# Altium project ORINIUM_UAV.PrjPcb (part 5 of 5)
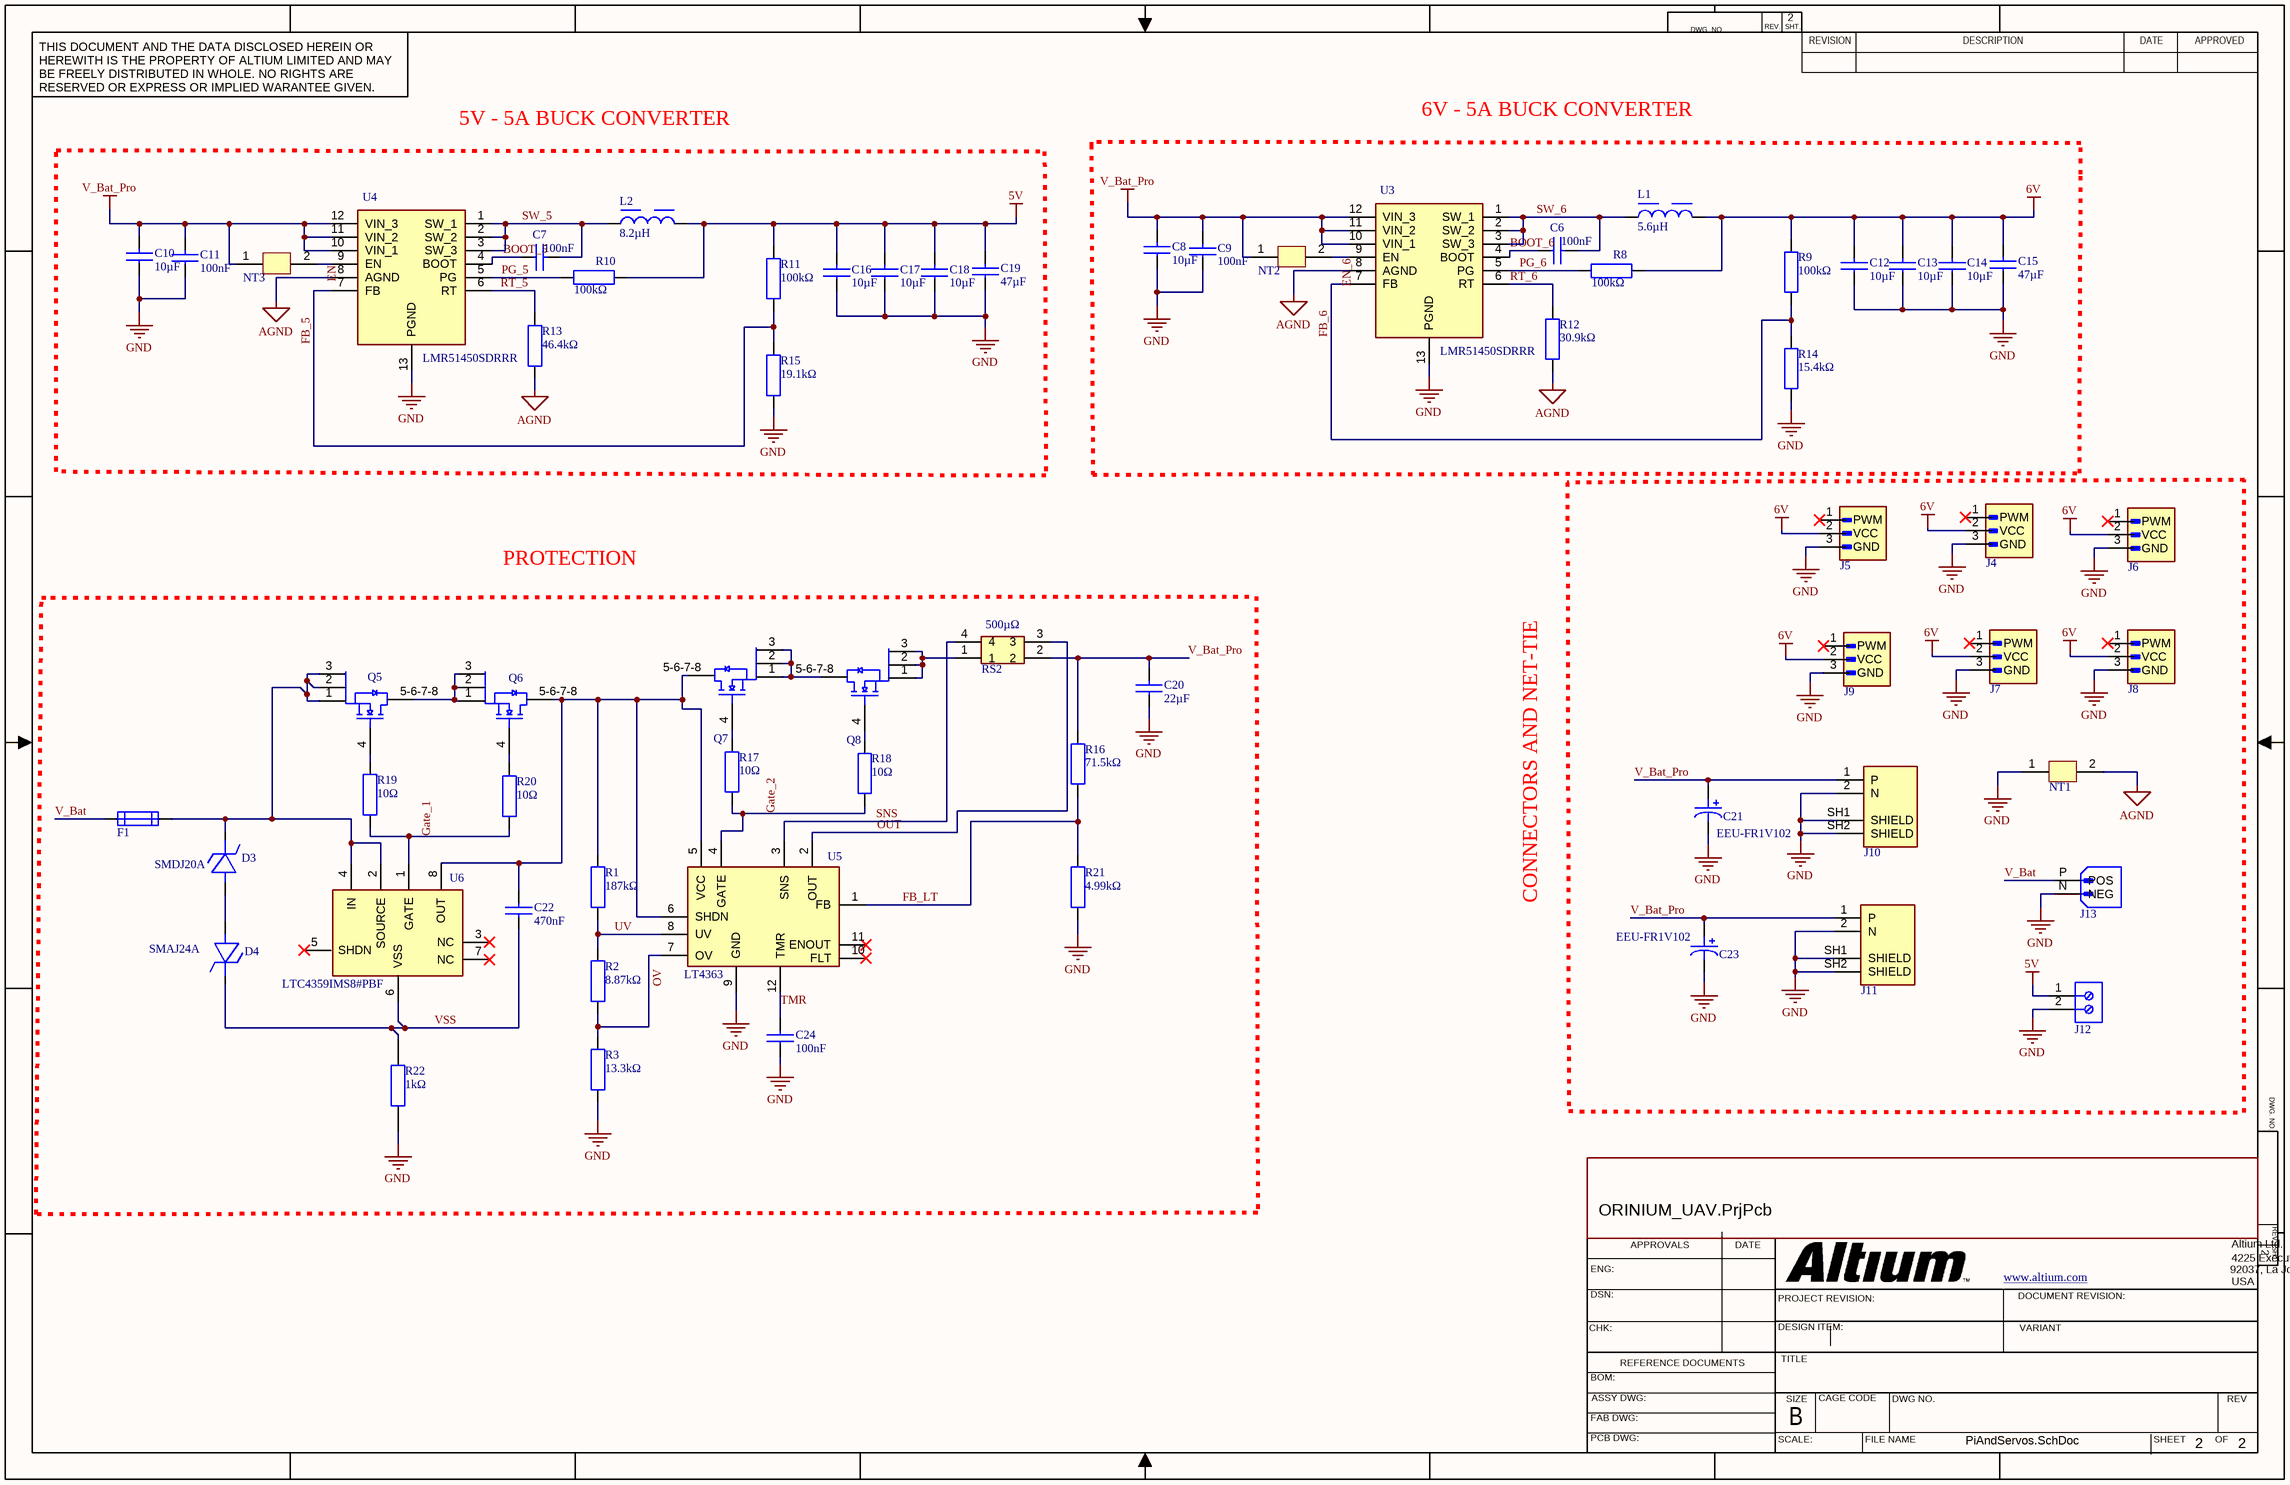
[diagram p4: PiAndServos.SchDoc]

## Sheet PiAndServos.SchDoc (continued)

### Library data of the parts (continued)
U6 = LTC4359IMS8#PBF: OR Controller N-Channel Single Automotive 8-Pin MSOP Tube / IC OR CTRLR N+1 8MSOP; Manufacturer: Analog Devices; Manufacturer Lifecycle Status: PRODUCTION; Max Output current: 180mA; Max Supply Voltage: 80V; Min Supply Voltage: 4V; Nominal Supply Current: 150µA; Number of Drivers: 1; Turn-Off Delay Time: 500ns; Supplier: Farnell; Supplier Part Number: LTC4359IMS8#PBF; Manufacturer Part Number: LTC4359IMS8#PBF; RoHS: Compliant; Category: Hot Swap Controllers; Stock: 348; Pricing: 1=9,08, 10=7,02, 50=6,69, 100=5,8, 250=5,55, 500=5,44 (EUR); Case/Package: MSOP; Lead Free: Lead Free; Lifecycle Status: Production; Max Operating Temperature: 85°C; Min Operating Temperature: -40°C; Number of Outputs: 1; Pins: 8; Schedule B: 8542310000, 8542390000, 8542390000|8542390000|8542390000|8542390000|8542390000|8542390000|8542390000|8542390000|8542390000|8542390000|8542390000|8542390000|8542390000|8542390000|8542390000|8542390000|8542390000|8542390000|8542390000|8542390000|8542390000|8542390000|8542390000|85; ComponentLink1URL: https://octopart.com:443/opatz8j6/c1?t=_P40TfJSJXDZt56jomm_QCaV2W9ovGhsmmsOr-jhAwoCJ8nBLABmPJZhMtd9jjF5hxL1_00-h1PSZMWNgisxjLor_nTRai5VSPSv7C30GKc6fB5Irl3JnoxXP6guWu3apPr0PFiiVpLUoXbJVRp6NFZQZkSSQtA-ym9nyDkwm4hFZ6aPWkuTkGMSIQRbKLFRiG3TpYClyGIEk8cre1-RNpxUfVtqVrzznXBdFvjW7k8HJfomxoh2QY9RslEN6MsN_sQCc8xlBgnroxPUy_RknD4svorm-bCFLp_eYvwDcJ65KenarPCoDA&src-supplier=Analog+Devices; ComponentLink1Description: https://octopart.com:443/opatz8j6/c1?t=_P40TfJSJXDZt56jomm_QCaV2W9ovGhsmmsOr-jhAwoCJ8nBLABmPJZhMtd9jjF5hxL1_00-h1PSZMWNgisxjLor_nTRai5VSPSv7C30GKc6fB5Irl3JnoxXP6guWu3apPr0PFiiVpLUoXbJVRp6NFZQZkSSQtA-ym9nyDkwm4hFZ6aPWkuTkGMSIQRbKLFRiG3TpYClyGIEk8cre1-RNpxUfVtqVrzznXBdFvjW7k8HJfomxoh2QY9RslEN6MsN_sQCc8xlBgnroxPUy_RknD4svorm-bCFLp_eYvwDcJ65KenarPCoDA&src-supplier=Analog+Devices; ComponentLink2URL: https://datasheet.octopart.com:443/LTC4359IMS8%23PBF-Analog-Devices-datasheet-140795748.pdf?src-supplier=element14+APAC; ComponentLink2Description: https://datasheet.octopart.com:443/LTC4359IMS8%23PBF-Analog-Devices-datasheet-140795748.pdf?src-supplier=element14+APAC; ComponentLink3URL: https://datasheet.octopart.com:443/LTC4359IMS8%23PBF-Analog-Devices-datasheet-158590489.pdf?src-supplier=Augswan; ComponentLink3Description: https://datasheet.octopart.com:443/LTC4359IMS8%23PBF-Analog-Devices-datasheet-158590489.pdf?src-supplier=Augswan; ComponentLink4URL: https://datasheet.octopart.com:443/LTC4359IMS8%23PBF-Linear-Technology-datasheet-57717354.pdf?src-supplier=Linear+Technology; ComponentLink4Description: https://datasheet.octopart.com:443/LTC4359IMS8%23PBF-Linear-Technology-datasheet-57717354.pdf?src-supplier=Linear+Technology; ComponentLink5URL: https://sigma.octopart.com:443/57689691/technical_drawing/Linear-Technology-LTC4359IMS8%23PBF.pdf?src-supplier=Linear+Technology; ComponentLink5Description: https://sigma.octopart.com:443/57689691/technical_drawing/Linear-Technology-LTC4359IMS8%23PBF.pdf?src-supplier=Linear+Technology; ComponentLink6URL: https://datasheet.octopart.com:443/LTC4359IMS8%23PBF-Linear-Technology-datasheet-11773680.pdf?src-supplier=Arrow+Electronics; ComponentLink6Description: https://datasheet.octopart.com:443/LTC4359IMS8%23PBF-Linear-Technology-datasheet-11773680.pdf?src-supplier=Arrow+Electronics; ComponentLink7URL: https://datasheet.octopart.com:443/LTC4359IMS8%23PBF-Analog-Devices-datasheet-14357927.pdf?src-supplier=Newchip+Electronics+Limited; ComponentLink7Description: https://datasheet.octopart.com:443/LTC4359IMS8%23PBF-Analog-Devices-datasheet-14357927.pdf?src-supplier=Newchip+Electronics+Limited; ComponentLink8URL: http://sigma.octopart.com:80/conflict_mineral_statement/Analog-Devices-company-33.pdf?src-supplier=Compliance+Statements; ComponentLink8Description: http://sigma.octopart.com:80/conflict_mineral_statement/Analog-Devices-company-33.pdf?src-supplier=Compliance+Statements; ComponentLink9URL: https://octopart.com:443/opatz8j6/c1?t=XMv486en4cgRczUhByXESygA7tzcWfPA65o52ghxq4CXCY5NS57rdy5GGbwVE8XfZyKs-Pss4HrKqDtDv8emV_VCOba_2B0i215LcHmypdXyqbKoV6hHKkyeszMd1G80nbJlVl28xOaq3ImAQwkx3MBKoeKSCRUWEeTh7O6SnaO6lulbOrhBpa7lUpYX2qexamutmNVBBP7Kuf_BfwVA6xNgWJaaLpoQaJnsVBxMCYgV8GT8S6w0VND9CLazxAvXxfuvXrc9_2mcoElFnkU-aAFDwJb3cbIgcdgtTW9GLMnN3gYe9mDzlQ&src-supplier=Compliance+Statements; ComponentLink9Description: https://octopart.com:443/opatz8j6/c1?t=XMv486en4cgRczUhByXESygA7tzcWfPA65o52ghxq4CXCY5NS57rdy5GGbwVE8XfZyKs-Pss4HrKqDtDv8emV_VCOba_2B0i215LcHmypdXyqbKoV6hHKkyeszMd1G80nbJlVl28xOaq3ImAQwkx3MBKoeKSCRUWEeTh7O6SnaO6lulbOrhBpa7lUpYX2qexamutmNVBBP7Kuf_BfwVA6xNgWJaaLpoQaJnsVBxMCYgV8GT8S6w0VND9CLazxAvXxfuvXrc9_2mcoElFnkU-aAFDwJb3cbIgcdgtTW9GLMnN3gYe9mDzlQ&src-supplier=Compliance+Statements